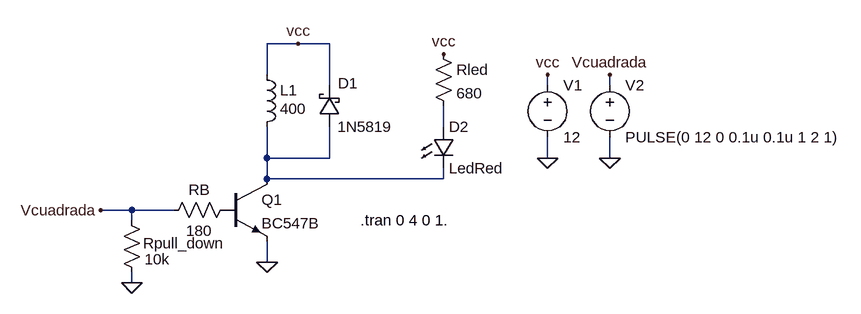
[diagram p0: schematic Etapa de Potencia.asc]
Etapa de Potencia.asc, the LTspice schematic file:
Version 4
SHEET 1 1136 680
WIRE 256 -128 208 -128
WIRE 304 -128 256 -128
WIRE 208 -80 208 -128
WIRE 304 -64 304 -128
WIRE 640 -64 640 -80
WIRE 736 -64 736 -80
WIRE 480 0 480 -32
WIRE 208 48 208 0
WIRE 304 48 304 0
WIRE 304 48 208 48
WIRE 640 48 640 16
WIRE 736 48 736 16
WIRE 208 80 208 48
WIRE 480 80 480 64
WIRE 480 80 208 80
WIRE 0 128 -48 128
WIRE 64 128 0 128
WIRE 0 144 0 128
WIRE 208 208 208 176
WIRE 0 240 0 224
FLAG 0 240 0
FLAG 256 -128 vcc
FLAG 208 208 0
FLAG 480 -112 vcc
FLAG 640 -80 vcc
FLAG 640 48 0
FLAG -48 128 Vcuadrada
FLAG 736 -80 Vcuadrada
FLAG 736 48 0
SYMBOL res 48 144 R270
WINDOW 0 32 56 VTop 2
WINDOW 3 0 56 VBottom 2
SYMATTR InstName RB
SYMATTR Value 180
SYMBOL res -16 128 R0
WINDOW 0 33 51 Left 2
WINDOW 3 36 76 Left 2
SYMATTR InstName Rpull_down
SYMATTR Value 10k
SYMBOL ind 192 -96 R0
WINDOW 3 36 68 Left 2
WINDOW 0 36 40 Left 2
SYMATTR Value 400
SYMATTR InstName L1
SYMBOL schottky 320 0 R180
WINDOW 0 -28 67 Left 2
WINDOW 3 -81 0 Left 2
SYMATTR InstName D1
SYMATTR Value 1N5819
SYMATTR Description Diode
SYMATTR Type diode
SYMBOL LED 464 0 R0
SYMATTR InstName D2
SYMATTR Value LedRed
SYMBOL res 464 -128 R0
WINDOW 0 36 40 Left 2
WINDOW 3 36 76 Left 2
SYMATTR InstName Rled
SYMATTR Value 680
SYMBOL npn 144 80 R0
SYMATTR InstName Q1
SYMATTR Value BC547B
SYMBOL voltage 640 -80 R0
SYMATTR InstName V1
SYMATTR Value 12
SYMBOL voltage 736 -80 R0
WINDOW 123 0 0 Left 2
WINDOW 39 0 0 Left 2
SYMATTR InstName V2
SYMATTR Value PULSE(0 12 0 0.1u 0.1u 1 2 1)
TEXT 352 144 Left 2 !.tran 0 4 0 1.

The netlist it stands for:
* Etapa de Potencia.asc
RB Vcuadrada P001 180
Rpull_down Vcuadrada 0 10k
L1 vcc N002 400
D1 N002 vcc 1N5819
D2 N001 N002 LedRed
Rled vcc N001 680
Q1 N002 P001 0 0 BC547B
V1 vcc 0 12
V2 Vcuadrada 0 PULSE(0 12 0 0.1u 0.1u 1 2 1)
.model D D
.lib standard.dio
.model NPN NPN
.model PNP PNP
.lib standard.bjt
.tran 0 4 0 1.
.backanno
.end